# EAGLE design YellowMotorEncoder (EAGLE 9.6.2)
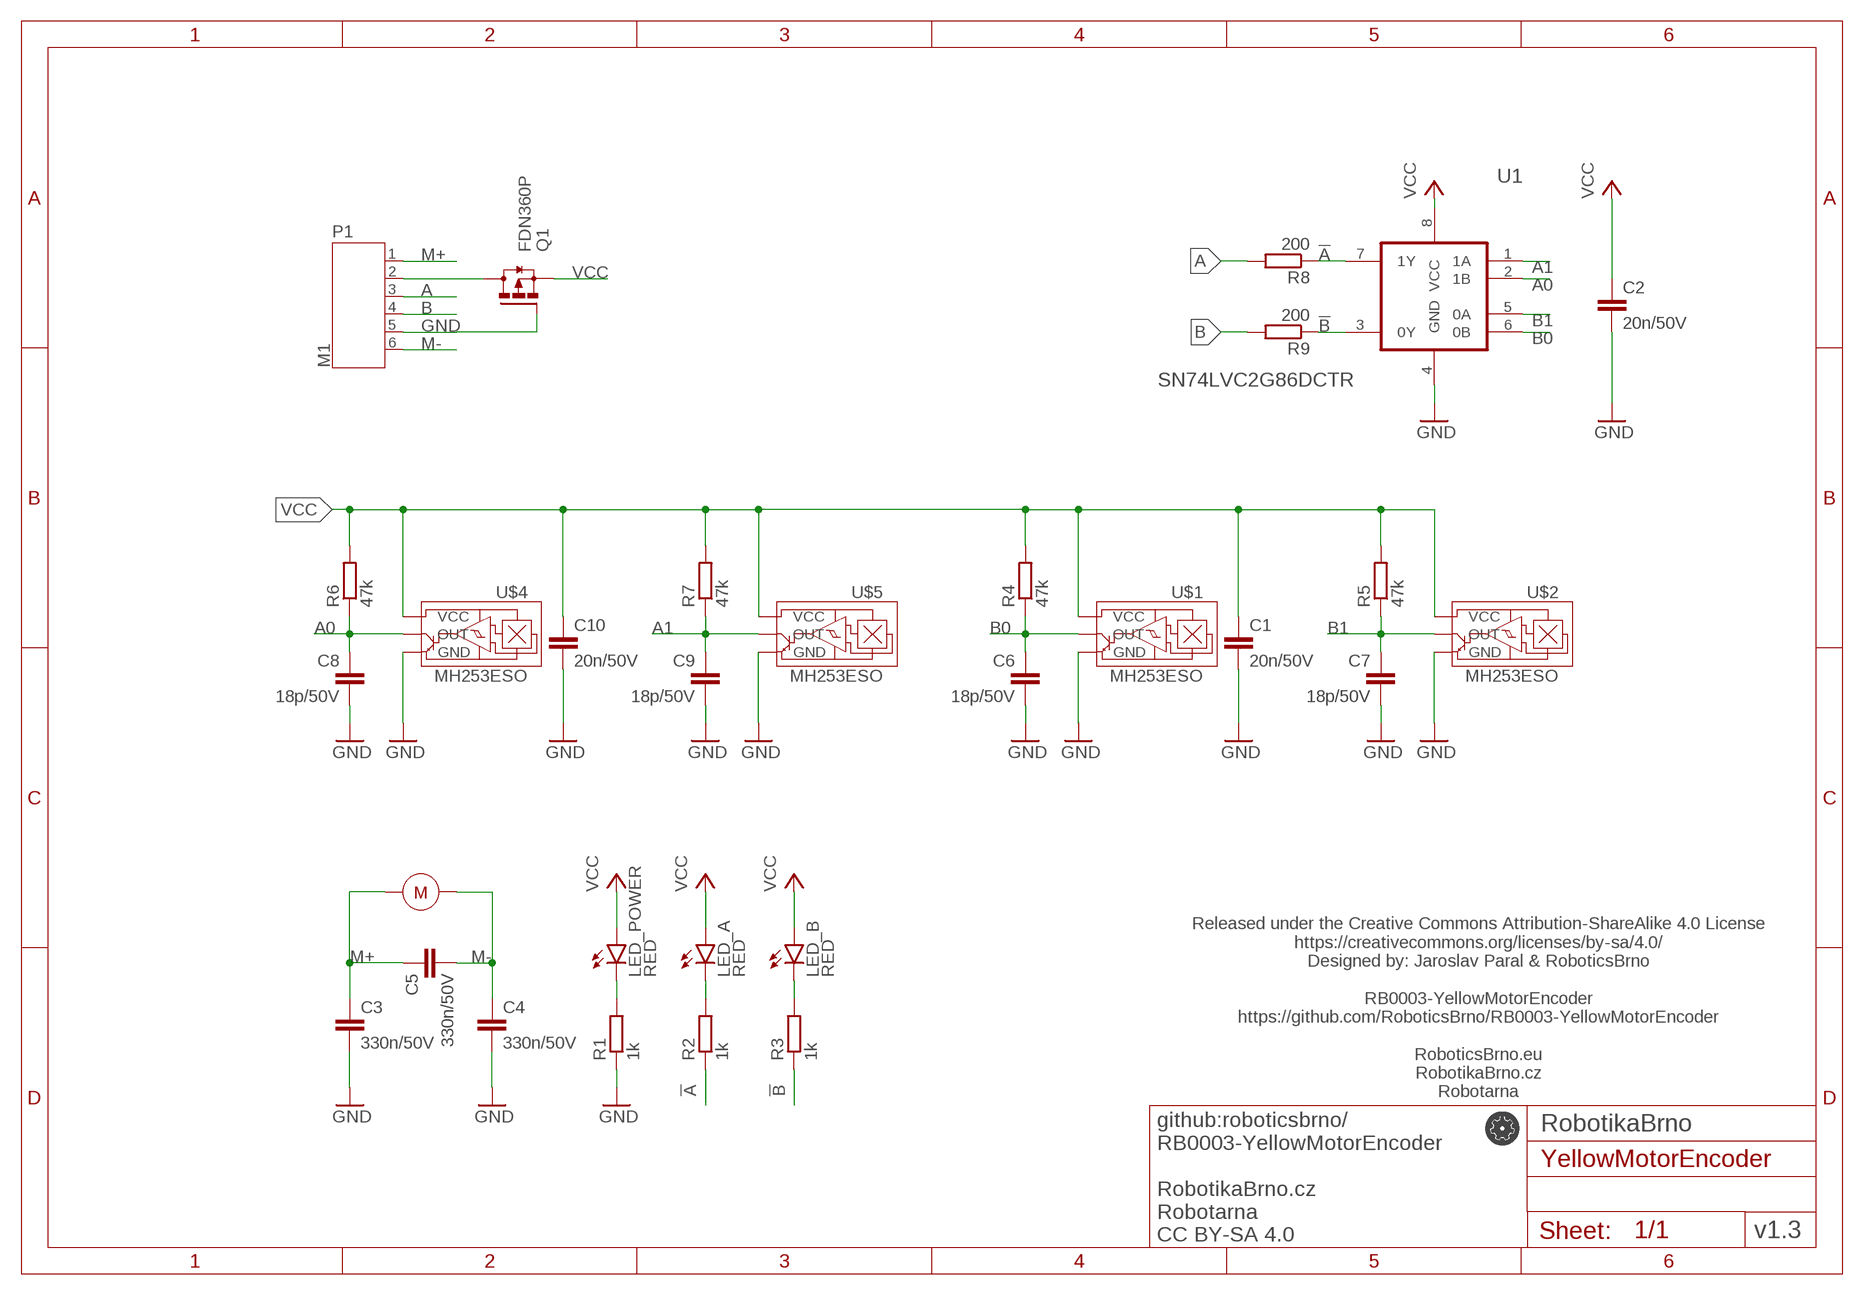
[diagram p0: schematic, sheet 1]

## Parts
C1  20n/50V  C-EUC0402  [C0402]
C2  20n/50V  C-EUC0402  [C0402]
C3  330n/50V  C-EUC0805  [C0805]
C4  330n/50V  C-EUC0805  [C0805]
C5  330n/50V  C-EUC0805  [C0805]
C6  18p/50V  C-EUC0402  [C0402]
C7  18p/50V  C-EUC0402  [C0402]
C8  18p/50V  C-EUC0402  [C0402]
C9  18p/50V  C-EUC0402  [C0402]
C10  20n/50V  C-EUC0402  [C0402]
LED_A  RED  LEDCHIPLED_0603  [CHIPLED_0603]
LED_B  RED  LEDCHIPLED_0603  [CHIPLED_0603]
LED_POWER  RED  LEDCHIPLED_0603  [CHIPLED_0603]
M1  YELLOW_MOTORV2  [YELLOW_MOTOR_V2]
P1  M1  JST-PH6  [JST-PH6]
Q1  FDN360P  [SUPER-SOT3]
R1  1k  R-EU_R0402  [R0402]
R2  1k  R-EU_R0402  [R0402]
R3  1k  R-EU_R0402  [R0402]
R4  47k  R-EU_R0402  [R0402]
R5  47k  R-EU_R0402  [R0402]
R6  47k  R-EU_R0402  [R0402]
R7  47k  R-EU_R0402  [R0402]
R8  200  R-EU_R0402  [R0402]
R9  200  R-EU_R0402  [R0402]
U1  SN74LVC2G86DCTR  [SOP65P400X130-8N]
U$1  MH253ESO  [SOT23]
U$2  MH253ESO  [SOT23]
U$4  MH253ESO  [SOT23]
U$5  MH253ESO  [SOT23]

## Nets
!A: R2.1 R8.1 U1.7(1Y)
!B: R3.1 R9.1 U1.3(0Y)
A: P1.3 R8.2
A0: C8.1 R6.1 U1.2(1B) U$4.2(OUT)
A1: C9.1 R7.1 U1.1(1A) U$5.2(OUT)
B: P1.4 R9.2
B0: C6.1 R4.1 U1.6(0B) U$1.2(OUT)
B1: C7.1 R5.1 U1.5(0A) U$2.2(OUT)
GND: C1.2 C2.2 C3.2 C4.2 C6.2 C7.2 C8.2 C9.2 C10.2 P1.5 Q1.1(G) R1.1 U1.4(GND) U$1.3(GND) U$2.3(GND) U$4.3(GND) U$5.3(GND)
LED_POWER: LED_POWER.C R1.2
LED_SIDE1: LED_A.C R2.2
LED_TOP1: LED_B.C R3.2
M+: C3.1 C5.1 M1.P$1 P1.1
M-: C4.1 C5.2 M1.P$2 P1.6
N$1: P1.2 Q1.3(D)
VCC: C1.1 C2.1 C10.1 LED_A.A LED_B.A LED_POWER.A Q1.2(S) R4.2 R5.2 R6.2 R7.2 U1.8(VCC) U$1.1(VCC) U$2.1(VCC) U$4.1(VCC) U$5.1(VCC)

## Notes on the sheet
- Released under the Creative Commons Attribution-ShareAlike 4.0 License
  https://creativecommons.org/licenses/by-sa/4.0/
  Designed by: Jaroslav Paral & RoboticsBrno
  
  RB0003-YellowMotorEncoder
  https://github.com/RoboticsBrno/RB0003-YellowMotorEncoder
  
  RoboticsBrno.eu
  RobotikaBrno.cz
  Robotarna
- RobotikaBrno
- v1.3
- github:roboticsbrno/
  RB0003-YellowMotorEncoder
  
  RobotikaBrno.cz
  Robotarna
  CC BY-SA 4.0

## Library data of the parts
C1 C2 C10 = rcl_upravena:C-EU: CAPACITOR, European symbol; DESCRIPTION: MULTILAYER CERAMIC CAPACITORS MLCC - SMD/SMT 10NF 50V 0402 ROHS; EXTENDED: NO; LCSC_ID: C15195; MF: Samsung Electro-Mechanics; MF_ID: CL05B103KB5NNNC; PACKAGE: 0402; PADS: 2; PRICE_1PLUS: $0.0054; PRICE_200PLUS: $0.0021; PRICE_DATE: 2020-05-08
C3-C5 = rcl:C-EU: CAPACITOR, European symbol; DESCRIPTION: MULTILAYER CERAMIC CAPACITORS MLCC - SMD/SMT 330NF 50V 0805 ROHS; EXTENDED: NO; LCSC_ID: C1740; MF: Guangdong Fenghua Advanced Tech; MF_ID: 0805B334K500NT; PACKAGE: 0805; PADS: 2; PRICE_1PLUS: $0.0227; PRICE_200PLUS: $0.0109; PRICE_DATE: 2020-05-08; SPICEPREFIX: C
C6-C9 = rcl_upravena:C-EU: CAPACITOR, European symbol; DESCRIPTION: MULTILAYER CERAMIC CAPACITORS MLCC - SMD/SMT 18PF 50V 0402 ROHS; EXTENDED: NO; LCSC_ID: C1549; MF: Guangdong Fenghua Advanced Tech; MF_ID: 0402CG180J500NT; PACKAGE: 0402; PADS: 2; PRICE_1000PLUS: $0.0006; PRICE_1PLUS: $0.0018; PRICE_DATE: 2020-05-08
LED_A LED_B LED_POWER = led:LED: LED OSRAM: - CHIPLED LG R971, LG N971, LY N971, LG Q971, LY Q971, LO R971, LY R971 LH N974, LH R974 LS Q976, LO Q976, LY Q976 LO Q996 - Hyper CHIPLED LW Q18S LB Q993, LB Q99A, LB R99A - SideLED LS A670, LO A670, LY A670, LG A670, LP A670 LB A673, LV A673, LT A673, LW A673 LH A674 LY A675 LS A676, LA A676, LO A676, LY A676, LW A676 LS A679, LY A679, LG A679 - Hyper Micro SIDELED® LS Y876, LA Y876, LO Y876, LY Y876 LT Y87S - SmartLED LW L88C, LW L88S LB L89C, LB L89S, LG L890 LS L89K, LO L89K, LY L89K LS L896, LA L896, LO L896, LY L896 - TOPLED LS T670, LO T670, LY T670, LG T670, LP T670 LSG T670, LSP T670, LSY T670, LOP T670, LYG T670 LG T671, LOG T671, LSG T671 LB T673, LV T673, LT T673, LW T673 LH T674 LS T676, LA T676, LO T676, LY T676, LB T676, LH T676, LSB T676, LW T676 LB T67C, LV T67C, LT T67C, LS T67K, LO T67K, LY T67K, LW E67C LS E67B, LA E67B, LO E67B, LY E67B, LB E67C, LV E67C, LT E67C LW T67C LS T679, LY T679, LG T679 LS T770, LO T770, LY T770, LG T770, LP T770 LB T773, LV T773, LT T773, LW T773 LH T774 LS E675, LA E675, LY E675, LS T675 LS T776, LA T776, LO T776, LY T776, LB T776 LHGB T686 LT T68C, LB T68C - Hyper Mini TOPLED® LB M676 - Mini TOPLED Santana® LG M470 LS M47K, LO M47K, LY M47K Source: http://www.osram.convergy.de LUXEON: - LUMILED® LXK2-PW12-R00, LXK2-PW12-S00, LXK2-PW14-U00, LXK2-PW14-V00 LXK2-PM12-R00, LXK2-PM12-S00, LXK2-PM14-U00 LXK2-PE12-Q00, LXK2-PE12-R00, LXK2-PE12-S00, LXK2-PE14-T00, LXK2-PE14-U00 LXK2-PB12-K00, LXK2-PB12-L00, LXK2-PB12-M00, LXK2-PB14-N00, LXK2-PB14-P00, LXK2-PB14-Q00 LXK2-PR12-L00, LXK2-PR12-M00, LXK2-PR14-Q00, LXK2-PR14-R00 LXK2-PD12-Q00, LXK2-PD12-R00, LXK2-PD12-S00 LXK2-PH12-R00, LXK2-PH12-S00 LXK2-PL12-P00, LXK2-PL12-Q00, LXK2-PL12-R00 Source: www.luxeon.com KINGBRIGHT: KA-3528ASYC Source: www.kingbright.com; DESCRIPTION: LIGHT EMITTING DIODES (LED) RED 520~625NM 90~100MCD@20MA TOP VIEW 0603 ROHS; DIGIKEY: 160-1446-1-ND; EXTENDED: NO; FARNELL: 2293494; LCSC_ID: C2286; MF: Hubei KENTO Elec; MF_ID: KT-0603R; MOUSER: 859-LTST-C191KGKT; PADS: 2; PRICE_1PLUS: $0.0079; PRICE_200PLUS: $0.0031; PRICE_DATE: 2020-03-27; RS: 872-1799
M1 = motor:YELLOW_MOTOR
P1 = jst-ph:JST-PH6
Q1 = transistor-power:FDN360P: Single P-Channel, PowerTrench (R) MOSFET Source: http://www.fairchildsemi.com/ds/FD/FDN360P.pdf
R1-R3 = rcl_upravena:R-EU_: RESISTOR, European symbol; DESCRIPTION: CHIP RESISTOR - SURFACE MOUNT 1KOHMS ±1% 1/10W 0603 ROHS; EXTENDED: NO; LCSC_ID: C21190; MF: Uniroyal Elec; MF_ID: 0603WAF1001T5E; PACKAGE: 0603; PADS: 2; PRICE_1000PLUS: $0.0005; PRICE_1PLUS: $0.0016; PRICE_DATE: 2020-05-08
R4-R9 = rcl_upravena:R-EU_: RESISTOR, European symbol; DESCRIPTION: CHIP RESISTOR - SURFACE MOUNT 47KOHMS ±1% 1/10W 0603 ROHS; EXTENDED: NO; LCSC_ID: C25819; MF: Uniroyal Elec; MF_ID: 0603WAF1001T5E; PACKAGE: 0603; PADS: 2; PRICE_1000PLUS: $0.0005; PRICE_1PLUS: $0.0016; PRICE_DATE: 2020-05-08
U1 = SN74LVC2G86DCTR:SN74LVC2G86DCTR: Check prices <https://pricing.snapeda.com/search/part/SN74LVC2G86DCTR/?ref=eda>; AVAILABILITY: Warning; DESCRIPTION: Dual 2-Input Exclusive-Or Gate 8-SM8 -40 to 125; MF: Texas Instruments; MP: SN74LVC2G86DCTR; PACKAGE: SSOP-8 Texas Instruments; PRICE: None; PURCHASE-URL: https://pricing.snapeda.com/search/part/SN74LVC2G86DCTR/?ref=eda
U$1 U$2 U$4 U$5 = hall_sensor:MH253ESO; EXTENDED: YES; LCSC_ID: C114369; MF: Magnesensor Tech (MST); MF_ID: MH253ESO; PACKAGE: SOT-23-3L; PADS: 3; PRICE_1000PLUS: 0.0889; PRICE_100PLUS: 0.0929; PRICE_10PLUS: 0.1049; PRICE_1PLUS: 0.1375; PRICE_DATE: 2020-05-01

## Net classes
0 default: width 0.15 mm, drill 0.3 mm, clearance 0.15 mm

## Board
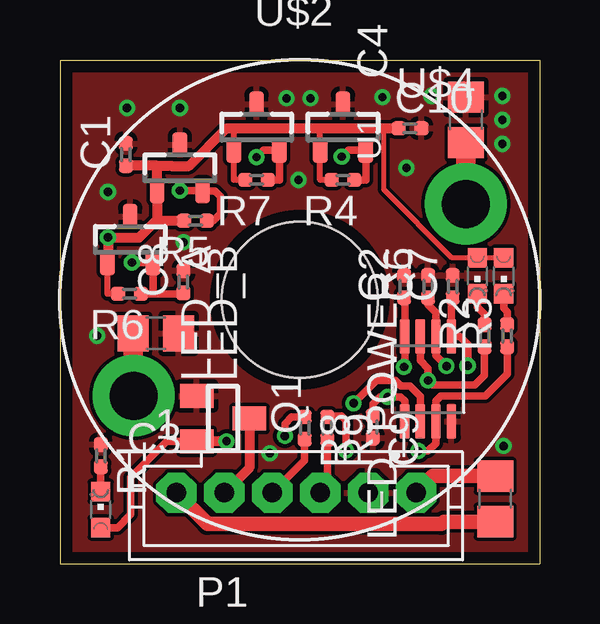
[diagram p1: board, top side]
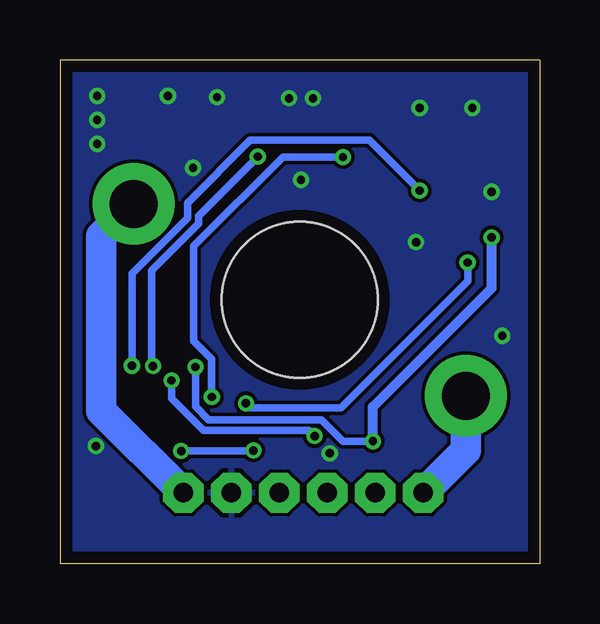
[diagram p2: board, bottom side, seen from below]

Size 20 x 21 mm. Coordinates in mm from the lower left corner, seen from the top.
Outline: 0,21 0,0 20,0 20,21 0,21
Copper layers (1*16): Top 0.035mm / dielectric 1.5mm / Bottom 0.035mm
Design rules "roboticsbrno": minimum track width 0.15mm, minimum drill 0.3mm, track to track 0.15mm, track to pad 0.15mm, pad to pad 0.15mm, via to via 0.15mm, smd to smd 0.15mm, copper to edge 0.5mm, drill to drill 0.5mm, minimum pad ring 0.16mm, minimum via ring 0.16mm, stop-mask expansion 0.1mm, vias tented up to drill 0.4mm, thermal gap 0.2mm

### Footprints (pad centres in the part's own frame; a part is rotated, then mirrored left to right if it is on the bottom)
C0402 = smd 0.6 x 0.58: 1 -0.465,0; 2 0.465,0
C0805 = smd 1.3 x 1.5: 1 -0.95,0; 2 0.95,0
CHIPLED_0603 = smd 0.8 x 0.8: A 0,-0.75; C 0,0.75
YELLOW_MOTOR_V2 = drill 2: P$1 -8,0; P$2 8,0 | hole 6.49: 0,0
JST-PH6 = drill 0.813 pad 1.676 octagon: 1 5,0; 2 3,0; 3 1,0; 4 -1,0; 5 -3,0; 6 -5,0
SUPER-SOT3 = smd 1 x 1.4: 1 -0.95,-1.1; 2 0.95,-1.1; 3 0,1.1
R0402 = smd 0.6 x 0.58: 1 -0.465,0; 2 0.465,0
SOP65P400X130-8N = smd 1.42 x 0.4: 1 -1.77,0.975; 2 -1.77,0.325; 3 -1.77,-0.325; 4 -1.77,-0.975; 5 1.77,-0.975; 6 1.77,-0.325; 7 1.77,0.325; 8 1.77,0.975
SOT23 = smd 1.05 x 0.61: 1 0.96,-0.95; 2 0.96,0.95; 3 -0.96,0

### Placement (x,y rotation side)
C1  2.75,17.05 90 top
C2  14.35,11.55 90 top
C3  4,9.6 0 top
C4  16.93,18.5 90 top
C5  18.15,2.7 90 top
C6  15.35,11.55 90 top
C7  16.38,11.55 90 top
C8  5.15,11.75 90 top
C9  13.05,5.7 270 top
C10  14.6,18.15 0 top
LED_A  17.4,12 180 top
LED_B  18.5,12 180 top
LED_POWER  1.7,2.25 0 top
M1  10,11 30 top
P1  9.85,2.95 180 top
Q1  6.8,6.05 270 top
R1  1.7,4.5 270 top
R2  17.7,9.5 90 top
R3  18.65,9.5 90 top
R4  11.8,16 180 top
R5  5.65,14.3 180 top
R6  2.9,11.25 180 top
R7  8.2,16 180 top
R8  10.2,5.65 270 top
R9  11.15,5.65 270 top
U1  15.35,7.7 90 top
U$1  11.8,18.2 270 top
U$2  5,16.5 270 top
U$4  2.93,13.51 270 top
U$5  8.2,18.2 270 top

### Tracks (layer width: path | path; a pad name or v marks a point on that pad's centre or on a via)
!A  (via drill 0.35)
  Top 0.305: R2.1 17.7,7.85 17.3,7.45 15.54,7.45 v15.35,7.63 15.35,8.13 15.03,8.46 U1.7 | R8.1 9.66,6.12 9.38,5.83 v9.38,5.32
  Bottom 0.305: v9.38,5.32 9.61,5.54 14.01,5.54 15.35,6.88 v15.35,7.63
!B  (via drill 0.35)
  Top 0.305: R3.1 18.65,7.9 17.74,6.99 15.89,6.99 15.68,6.78 U1.3 15.68,5.02 15.35,4.69 v14.94,4.69 | v11.94,4.71 11.94,5.96 11.73,6.17 11.2,6.17 R9.1
  Bottom 0.305: v14.94,4.69 11.96,4.69 v11.94,4.71
A
  Top 0.305: P1.3 10.2,4.3 R8.2
A0  (via drill 0.35)
  Top 0.305: R6.1 3.88,11.25 | 3.88,11.25 U$4.2 v3,12.55 | U1.2 15.03,6.97 14.59,7.41 14.23,7.41 14,7.63 13.19,7.63 v12.24,6.68 | 3.88,11.25 5.12,11.25 C8.1
  Bottom 0.305: v12.24,6.68 12.05,6.49 8.27,6.49 2.99,11.77 2.99,12.54 v3,12.55
A1  (via drill 0.35)
  Top 0.305: R7.1 9.15,16 U$5.2 8.49,17.24 v8.2,16.95 | C9.1 13.05,6.65 13.35,6.95 v13.67,6.95 14.2,6.95 14.38,6.78 U1.1
  Bottom 0.305: v8.2,16.95 10.71,16.95 14.42,13.24 14.42,9.29 13.67,8.53 v13.67,6.95
B
  Top 0.305: R9.2 11.15,3.25 P1.4
B0  (via drill 0.35)
  Top 0.305: C6.1 15.35,10.8 15.68,10.47 U1.6 15.68,8.68 v16.12,8.23 | R4.1 12.75,16 U$1.2 12.02,17.24 v11.75,16.97
  Bottom 0.305: v16.12,8.23 16.18,8.29 16.18,12.23 14.23,14.18 14.23,14.49 v11.75,16.97
B1  (via drill 0.35)
  Top 0.305: C7.1 16.32,11.04 U1.5 16.68,9.47 17,9.14 v17,8.25 | R5.1 6.4,14.3 6.7,14.6 6.7,15.3 6.46,15.54 U$2.2 v5,15.55
  Bottom 0.305: v5,15.55 7.1,17.65 12.07,17.65 14.68,15.03 14.68,14.41 17,12.09 v17,8.25
GND  (via drill 0.35)
  other vias: 1.55,9.5 5.15,13.4 9.95,16 9.45,19.4 10.45,19.4 5,19 13.45,19.45 15.5,19.5 18.45,19.5 2,15.5 8.75,4.6 18.5,4.9 2.8,19 18.45,18.5 18.45,17.5 14.45,16.5
  pour Bottom: -1,-1 21,-1 21,21 20,22 0,22 -1,21
  pour Top: -2,-2 22,-2 22,22 21,23 0,23 -2,21
LED_POWER
  Top 0.305: LED_POWER.C R1.2
LED_SIDE1
  Top 0.305: R2.2 17.7,10.4 17.4,10.7 LED_A.C
LED_TOP1
  Top 0.305: LED_B.C 18.5,10.65 18.65,10.5 R3.2
M+
  Top 0.61: C5.1 16,1.75 15.9,1.65 6.15,1.65 P1.1
  Top 0.813: M1.P$1 3.05,7.02 C3.1
  Bottom 1.27: P1.1 3.07,4.73 M1.P$1
M-
  Top 0.61: P1.6 15.55,3.65 C5.2
  Top 0.813: M1.P$2 C4.1
  Bottom 1.27: P1.6 18.27,6.37 18.27,13.65 M1.P$2
N$1
  Top 0.406: Q1.3 7.9,4 P1.2
VCC  (via drill 0.35)
  Top 0.203: LED_B.A LED_A.A 16.35,12.75 13.5,15.6 13.5,18.15
  Top 0.254: 8,18.15 7.25,18.15 U$5.1 7.25,16 R7.2 | 11,18.15 10.85,18.15 U$1.1 10.85,16 R4.2 | R6.2 1.98,11.25 U$4.1
  Top 0.305: LED_POWER.A 2.4,1.5 2.95,2.05 2.95,3.6 4.45,5.1 Q1.2 | C2.1 14.38,11.06 U1.8 14.38,8.47 14.35,8.45 v14.35,8.2
  Top 0.406: v6.95,5.1 Q1.2 | 4,14.3 R5.2 | 4,14.3 3.29,13.59 2.01,13.59 v2,13.6 2,12.57 U$4.1 | 4,14.3 4.05,14.35 U$2.1 4.05,16.59 | 4.05,16.59 C1.1 | 4.05,16.59 4.63,16.59 4.64,16.58 5.38,16.58 6.95,18.15 8,18.15 11,18.15 13.5,18.15 C10.1
  Bottom 0.305: v6.95,5.1 8.2,5.1 9.1,6 13.8,6 14.35,6.55 v14.35,8.2
  Bottom 0.406: v6.95,5.1 6.95,6.54 2,11.49 v2,13.6